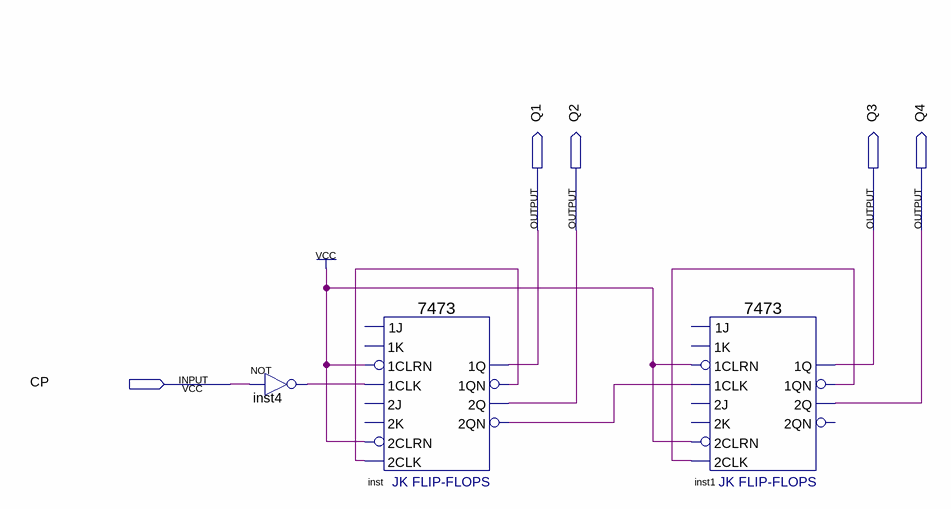
[diagram p0: schematic sheet]
// Quartus schematic pj701.bdf as structural Verilog: 3 symbols, 5 pins
module pj701 (
  input  CP,
  output Q1,
  output Q2,
  output Q3,
  output Q4
);

  wire inst1_1qn, inst4_out, inst_1qn, inst_2qn;

  not inst4 (inst4_out, CP);
  \7473  inst (
    .\1CLRN (1'b1), .\1CLK (inst4_out), .\2CLK (inst_1qn), .\2CLRN (1'b1), .\1QN (inst_1qn), .\2Q (Q2),
    .\2QN (inst_2qn), .\1Q (Q1));  // open: 1J, 1K, 2J, 2K
  \7473  inst1 (
    .\1CLRN (1'b1), .\1CLK (inst_2qn), .\2CLK (inst1_1qn), .\2CLRN (1'b1), .\1QN (inst1_1qn), .\2Q (Q4),
    .\1Q (Q3));  // open: 1J, 1K, 2J, 2K, 2QN
endmodule
